# EAGLE design ESP_DIN_V1.1 (EAGLE 9.0.1)
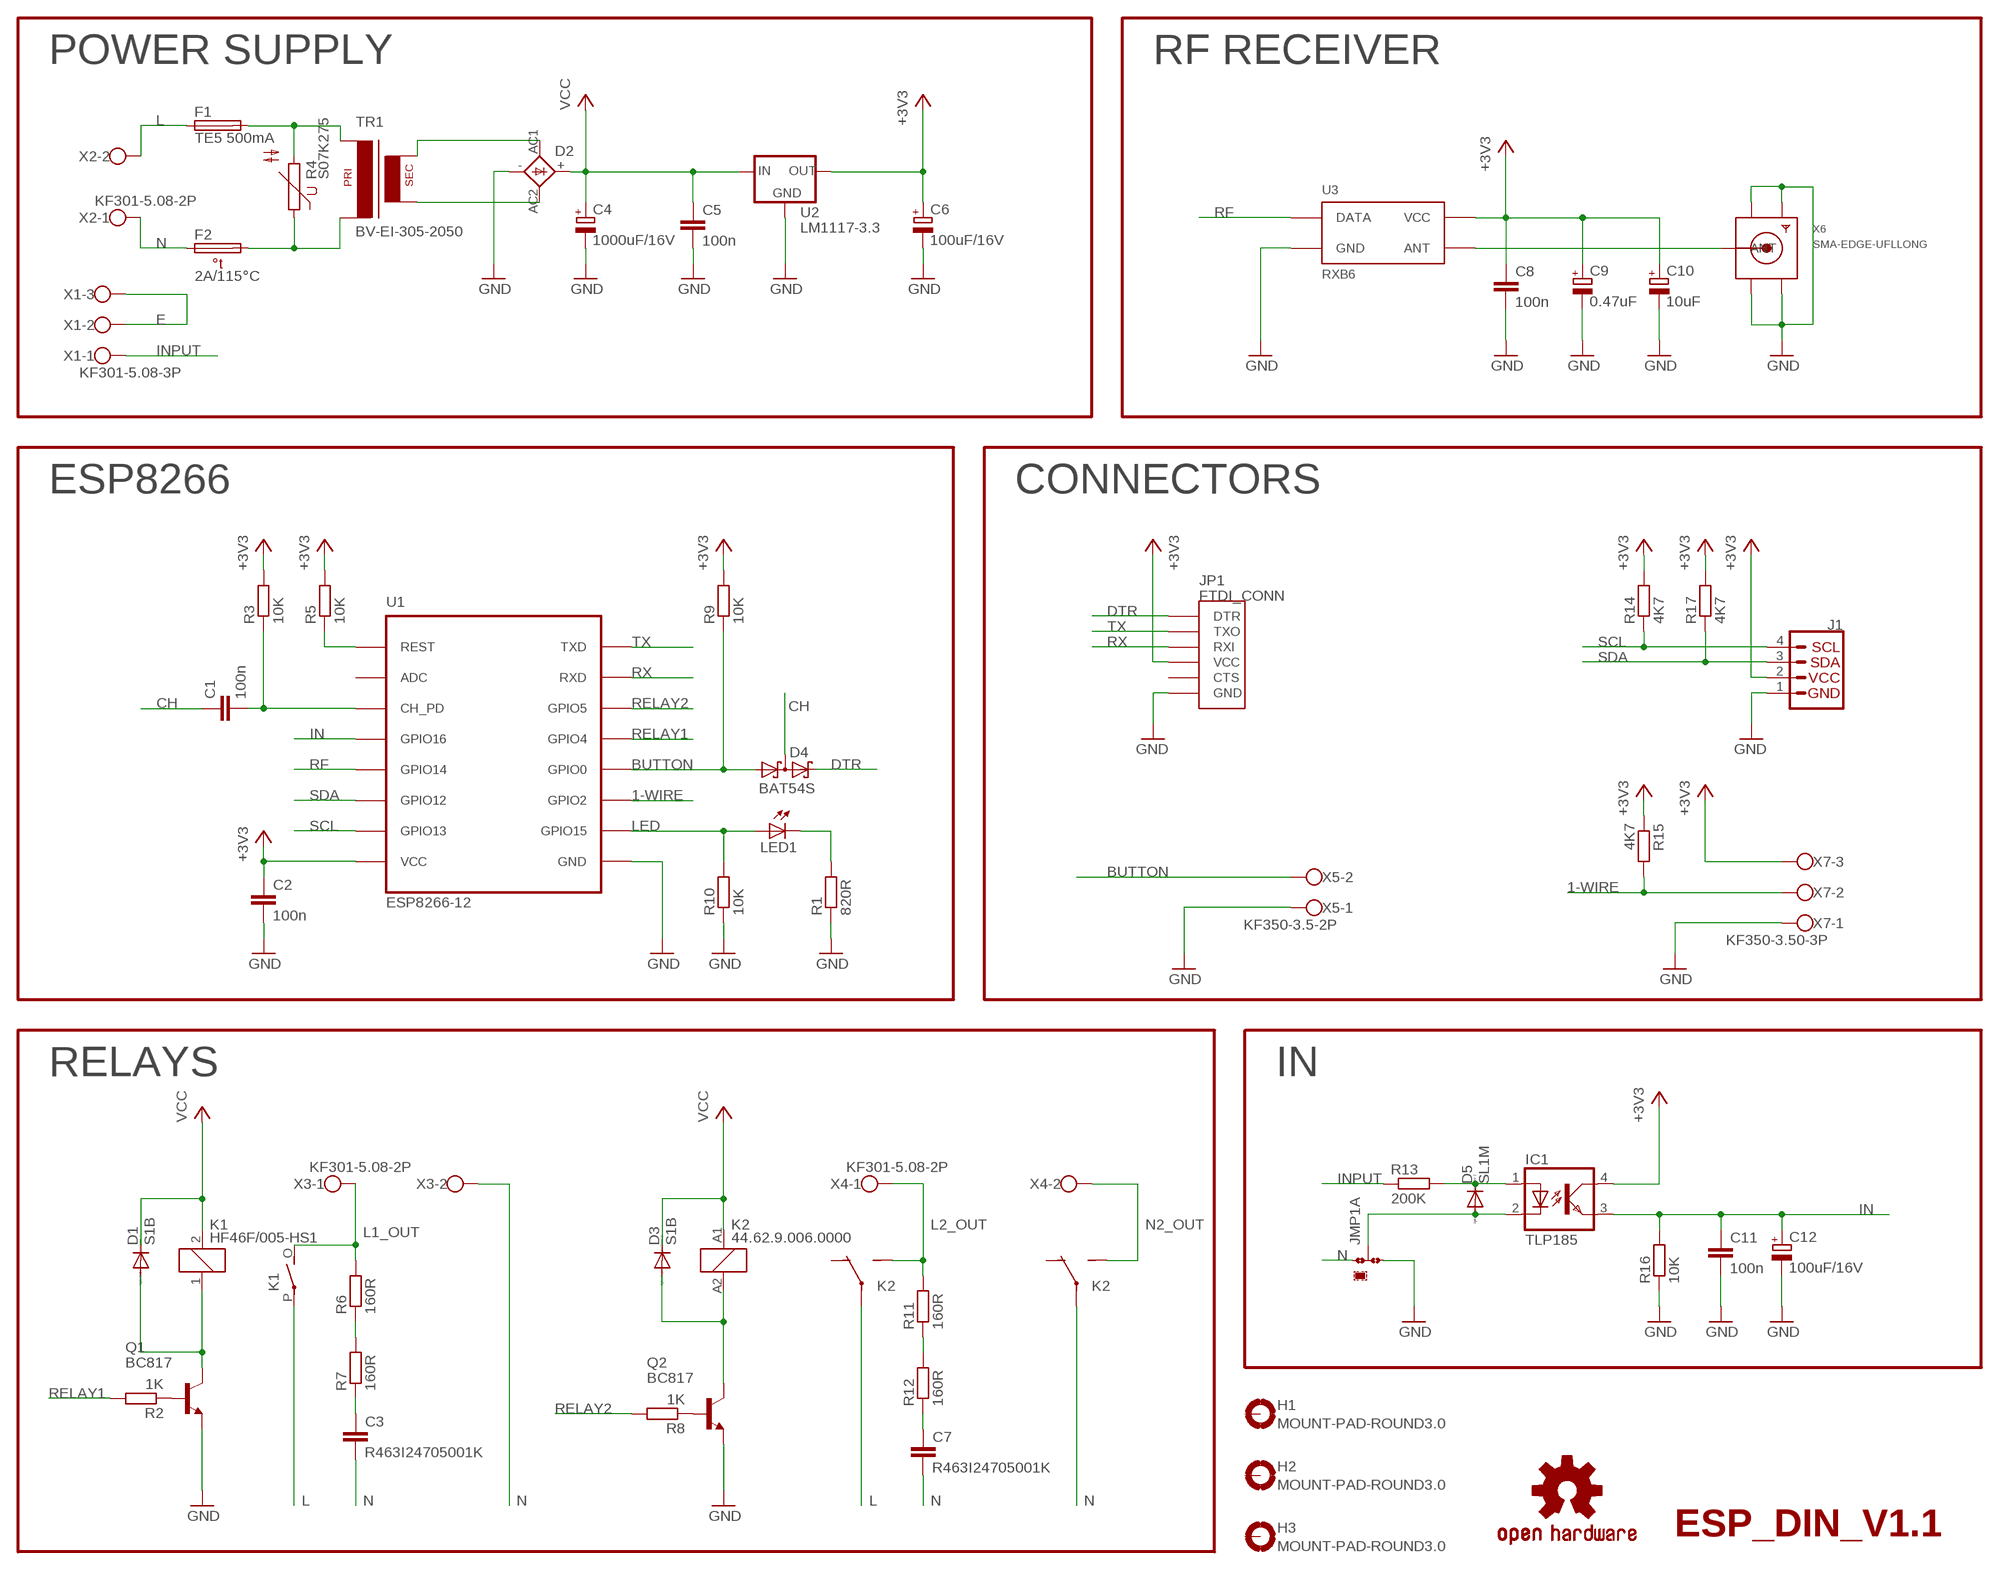
[diagram p0: schematic, sheet 1]

## Parts
C1  100n  C-EUC0805  [C0805]
C2  100n  C-EUC0805  [C0805]
C3  R463I24705001K  C-EU150-084X183  [C150-084X183]
C4  1000uF/16V  CPOL-EUTT5D10  [TT5D10]
C5  100n  C-EUC0805  [C0805]
C6  100uF/16V  CPOL-EUE2-5  [E2-5]
C7  R463I24705001K  C-EU150-084X183  [C150-084X183]
C8  100n  C-EUC0805  [C0805]
C9  0.47uF  CPOL-EUSMCA  [SMC_A]
C10  10uF  CPOL-EUSMCA  [SMC_A]
C11  100n  C-EUC0805  [C0805]
C12  100uF/16V  CPOL-EUE2-5  [E2-5]
D1  S1B  [DO214AC]
D2  KBP307  [KBP307]
D3  S1B  [DO214AC]
D4  BAT54S  [SOT23]
D5  SL1M  [SOD123]
F1  TE5 500mA  TE5  [TE5]
F2  2A/115°C  THERMAL_CUTOFF  [THERMAL_6.35]
H1  MOUNT-PAD-ROUND3.0  [3,0-PAD]
H2  MOUNT-PAD-ROUND3.0  [3,0-PAD]
H3  MOUNT-PAD-ROUND3.0  [3,0-PAD]
IC1  TLP185  [SOP04]
J1  I2C_STANDARD_NO_SILK  [1X04_NO_SILK]
JMP1  JUMPER-0R-2010-A  [JUMPER-0R-2010-A]
JP1  FTDI_CONN  [FTDI]
K1  HF46F/005-HS1  HF46F-G/006-HS1  [HF46F]
K2  44.62.9.006.0000  [44.52]
LED1  LED3MM  [LED3MM]
LOGO1  OSHW-LOGOM-COPPER  [OSHW-LOGO-M_COPPER]
Q1  BC817  BC817-40SMD  [SOT23-BEC]
Q2  BC817  BC817-40SMD  [SOT23-BEC]
R1  820R  R-EU_R0805  [R0805]
R2  1K  R-EU_R0805  [R0805]
R3  10K  R-EU_R0805  [R0805]
R4  S07K275  S07K250  [S07K250]
R5  10K  R-EU_R0805  [R0805]
R6  160R  R-EU_R2010  [R2010]
R7  160R  R-EU_R2010  [R2010]
R8  1K  R-EU_R0805  [R0805]
R9  10K  R-EU_R0805  [R0805]
R10  10K  R-EU_R0805  [R0805]
R11  160R  R-EU_R2010  [R2010]
R12  160R  R-EU_R2010  [R2010]
R13  200K  R-EU_R2010  [R2010]
R14  4K7  R-EU_R0805  [R0805]
R15  4K7  R-EU_R0805  [R0805]
R16  10K  R-EU_R0805  [R0805]
R17  4K7  R-EU_R0805  [R0805]
TR1  BV-EI-305-2050  [EI30-1]
U1  ESP8266-12  [ESP-12]
U2  LM1117-3.3  [SOT223]
U3  RXB6  [RXB6]
X1  KF301-5.08-3P  [KF301-5.08-3P]
X2  KF301-5.08-2P  [KF301-5.08-2P]
X3  KF301-5.08-2P  [KF301-5.08-2P]
X4  KF301-5.08-2P  [KF301-5.08-2P]
X5  KF350-3.5-2P  [KF350-3.50-2P]
X6  SMA-EDGE-UFLLONG  [SMA_EDGE_UFL_W]
X7  KF350-3.50-3P  [KF350-3.50-3P]

## Nets
1-WIRE: R15.2 U1.GPIO2 X7.2
+3V3: C2.1 C6.+ C8.1 C9.+ C10.+ IC1.4(COL) J1.2 JP1.P$4(VCC) R3.2 R5.2 R9.2 R14.2 R15.1 R17.2 U1.VCC U2.2(OUT) U2.4(OUT) U3.VCC U3.VCC@1(VCC) X7.3
ANT: U3.ANT X6.P(ANT)
BUTTON: D4.1(A1) R9.1 U1.GPIO0 X5.2
CH: C1.1 D4.3(C1A2)
DTR: D4.2(C2) JP1.P$1(DTR)
E: X1.2 X1.3
GND: C2.2 C4.- C5.2 C6.- C8.2 C9.- C10.- C11.2 C12.- D2.- J1.1 JMP1.3 JP1.P$6(GND) Q1.E Q2.E R1.1 R10.1 R16.1 U1.GND U2.1(GND) U3.GND U3.GND@1(GND) U3.GND@2(GND) X5.1 X6.GND@1(GND1) X6.GND@2(GND2) X6.GND@3(GND3) X6.GND@4(GND4) X7.1
IN: C11.1 C12.+ IC1.3(EMIT) R16.2 U1.GPIO16
INPUT: R13.1 X1.1
K1_POLE1: D1.A K1.1 Q1.C
K2_POLE1: D3.A K2.A2 Q2.C
L [220V]: F1.1 K1.P K2.11(P) X2.2
L1_OUT [220V]: K1.O(NO) R6.2 X3.1
L2_OUT [220V]: K2.14(NO) R11.2 X4.1
LED: LED1.A R10.2 U1.GPIO15
N [220V]: C3.2 C7.2 F2.1 JMP1.1 K2.21(P) X2.1 X3.2
N2_OUT [220V]: K2.24(NO) X4.2
N$2: Q2.B R8.1
N$3: D2.AC1 TR1.9(S4)
N$4: D2.AC2 TR1.7(S3)
N$5: LED1.K(C) R1.2
N$6: D5.A IC1.2(C) JMP1.2
N$7: D5.C IC1.1(A) R13.2
N$8: F1.2 R4.2 TR1.1
N$9: C3.1 R7.1
N$10: R5.1 U1.REST
N$11: C1.2 R3.1 U1.CH_PD
N$12: R6.1 R7.2
N$13: C7.1 R12.1
N$14: F2.2 R4.1 TR1.5(P2)
N$15: R11.1 R12.2
N$16: Q1.B R2.1
RELAY1: R2.2 U1.GPIO5(GPIO4)
RELAY2: R8.2 U1.GPIO4(GPIO5)
RF: U1.GPIO14 U3.DATA
RX: JP1.P$3(RXI) U1.RXD
SCL: J1.4 R14.1 U1.GPIO13
SDA: J1.3 R17.1 U1.GPIO12
TX: JP1.P$2(TXO) U1.TXD
VCC: C4.+ C5.1 D1.C D2.+ D3.C K1.2 K2.A1 U2.3(IN)
Unconnected: H1.B3,0(MOUNT) H2.B3,0(MOUNT) H3.B3,0(MOUNT) JP1.P$5(CTS) K2.12(NC) K2.22(NC) U1.ADC

## Notes on the sheet
- POWER SUPPLY | RF RECEIVER
- ESP8266 | CONNECTORS
- RELAYS | IN
- ESP_DIN_V1.1

## Library data of the parts
C1 C8 = rcl:C-EU: CAPACITOR, European symbol
C2 C3 C5 C7 C11 = rcl:C-EU: CAPACITOR, European symbol; SPICEPREFIX: C
C4 C6 C9 C10 C12 = rcl:CPOL-EU: POLARIZED CAPACITOR, European symbol; SPICEPREFIX: C
D1 D3 = my-diode:S?*: Rectifier Diode; V: 70
D2 = my-diode:KBP307: Bridge Rectifier
D4 = diode:BAT54S: Schottky Diodes Pin connection corrected 2011-05-04 Source: Fairchild .. BAT54.pdf
D5 = my-diode:SL1*: Silicon Rectifier Diode; V: 1000
F1 = fuse:TE5: FUSE Wickmann; OC_FARNELL: unknown; OC_NEWARK: unknown
F2 = my-fuses:THERMAL_CUTOFF
H1-H3 = holes:MOUNT-PAD-ROUND: MOUNTING PAD, round
IC1 = my-opto:TLP185: Photocoupler
J1 = SparkFun-Connectors:I2C_STANDARD: SparkFun I2C Standard Pinout Header SparkFun has standardized on a pinout for all I2C based sensor breakouts. This pinout allows I2C boards to be plugged directly into the headers on Arduino Uno compatible boards, and to be daisy chained easily. Example SparkFun Products: SparkFun Atmospheric Sensor Breakout - BME280 <https://www.sparkfun.com/products/13676> SparkFun Altitude/Pressure Sensor Breakout - MPL3115A2 <https://www.sparkfun.com/products/11084> SparkFun TOF Range Finder Sensor - VL6180 <https://www.sparkfun.com/products/12785>
JMP1 = my-jumper:JUMPER-0R-?-A: 0R jumper
JP1 = my-connectors:FTDI_CONN: Connector which mates to FTDI basic or FTDI cable.
K1 = my-relay:HF46F-G/*-HS1: Subminiature power relay
K2 = my-relay:44.62.9.*.0000: Miniature PCB relay 8A
LED1 = led:LED: LED OSRAM: - CHIPLED LG R971, LG N971, LY N971, LG Q971, LY Q971, LO R971, LY R971 LH N974, LH R974 LS Q976, LO Q976, LY Q976 LO Q996 - Hyper CHIPLED LW Q18S LB Q993, LB Q99A, LB R99A - SideLED LS A670, LO A670, LY A670, LG A670, LP A670 LB A673, LV A673, LT A673, LW A673 LH A674 LY A675 LS A676, LA A676, LO A676, LY A676, LW A676 LS A679, LY A679, LG A679 - Hyper Micro SIDELED® LS Y876, LA Y876, LO Y876, LY Y876 LT Y87S - SmartLED LW L88C, LW L88S LB L89C, LB L89S, LG L890 LS L89K, LO L89K, LY L89K LS L896, LA L896, LO L896, LY L896 - TOPLED LS T670, LO T670, LY T670, LG T670, LP T670 LSG T670, LSP T670, LSY T670, LOP T670, LYG T670 LG T671, LOG T671, LSG T671 LB T673, LV T673, LT T673, LW T673 LH T674 LS T676, LA T676, LO T676, LY T676, LB T676, LH T676, LSB T676, LW T676 LB T67C, LV T67C, LT T67C, LS T67K, LO T67K, LY T67K, LW E67C LS E67B, LA E67B, LO E67B, LY E67B, LB E67C, LV E67C, LT E67C LW T67C LS T679, LY T679, LG T679 LS T770, LO T770, LY T770, LG T770, LP T770 LB T773, LV T773, LT T773, LW T773 LH T774 LS E675, LA E675, LY E675, LS T675 LS T776, LA T776, LO T776, LY T776, LB T776 LHGB T686 LT T68C, LB T68C - Hyper Mini TOPLED® LB M676 - Mini TOPLED Santana® LG M470 LS M47K, LO M47K, LY M47K Source: http://www.osram.convergy.de LUXEON: - LUMILED® LXK2-PW12-R00, LXK2-PW12-S00, LXK2-PW14-U00, LXK2-PW14-V00 LXK2-PM12-R00, LXK2-PM12-S00, LXK2-PM14-U00 LXK2-PE12-Q00, LXK2-PE12-R00, LXK2-PE12-S00, LXK2-PE14-T00, LXK2-PE14-U00 LXK2-PB12-K00, LXK2-PB12-L00, LXK2-PB12-M00, LXK2-PB14-N00, LXK2-PB14-P00, LXK2-PB14-Q00 LXK2-PR12-L00, LXK2-PR12-M00, LXK2-PR14-Q00, LXK2-PR14-R00 LXK2-PD12-Q00, LXK2-PD12-R00, LXK2-PD12-S00 LXK2-PH12-R00, LXK2-PH12-S00 LXK2-PL12-P00, LXK2-PL12-Q00, LXK2-PL12-R00 Source: www.luxeon.com KINGBRIGHT: KA-3528ASYC Source: www.kingbright.com
LOGO1 = SparkFun-Aesthetics:OSHW-LOGO: Open-Source Hardware (OSHW) Logo This logo indicates the piece of hardware it is found on incorporates a OSHW license and/or adheres to the definition of open source hardware found here: http://freedomdefined.org/OSHW
Q1 Q2 = transistor-npn:BC817*: NPN Transistor
R1-R3 R5-R17 = rcl:R-EU_: RESISTOR, European symbol; SPICEPREFIX: R
R4 = varistor:S07K250: VARISTOR
TR1 = my-power:BV-EI-?*: Transformer; VOLTAGE: 6
U1 = my-ESP8266:ESP8266
U2 = my-power:LM1117-*: LDO regulator
U3 = my-modules:RXB6: 433mHz receiver
X1 = my-connectors:KF301-?-3P: Screw terminal
X2-X4 = my-connectors:KF301-?-2P: Screw terminal
X5 = my-connectors:KF350-3.5-2P: Screw terminal 3.5mm pitch
X6 = my-connectors:SMA-EDGE-UFL: SMA connector
X7 = my-connectors:KF350-3.50-3P: Screw terminal 3.5mm pitch

## Net classes
1 220V: width 1.8 mm, clearance 0.2 mm

## Board
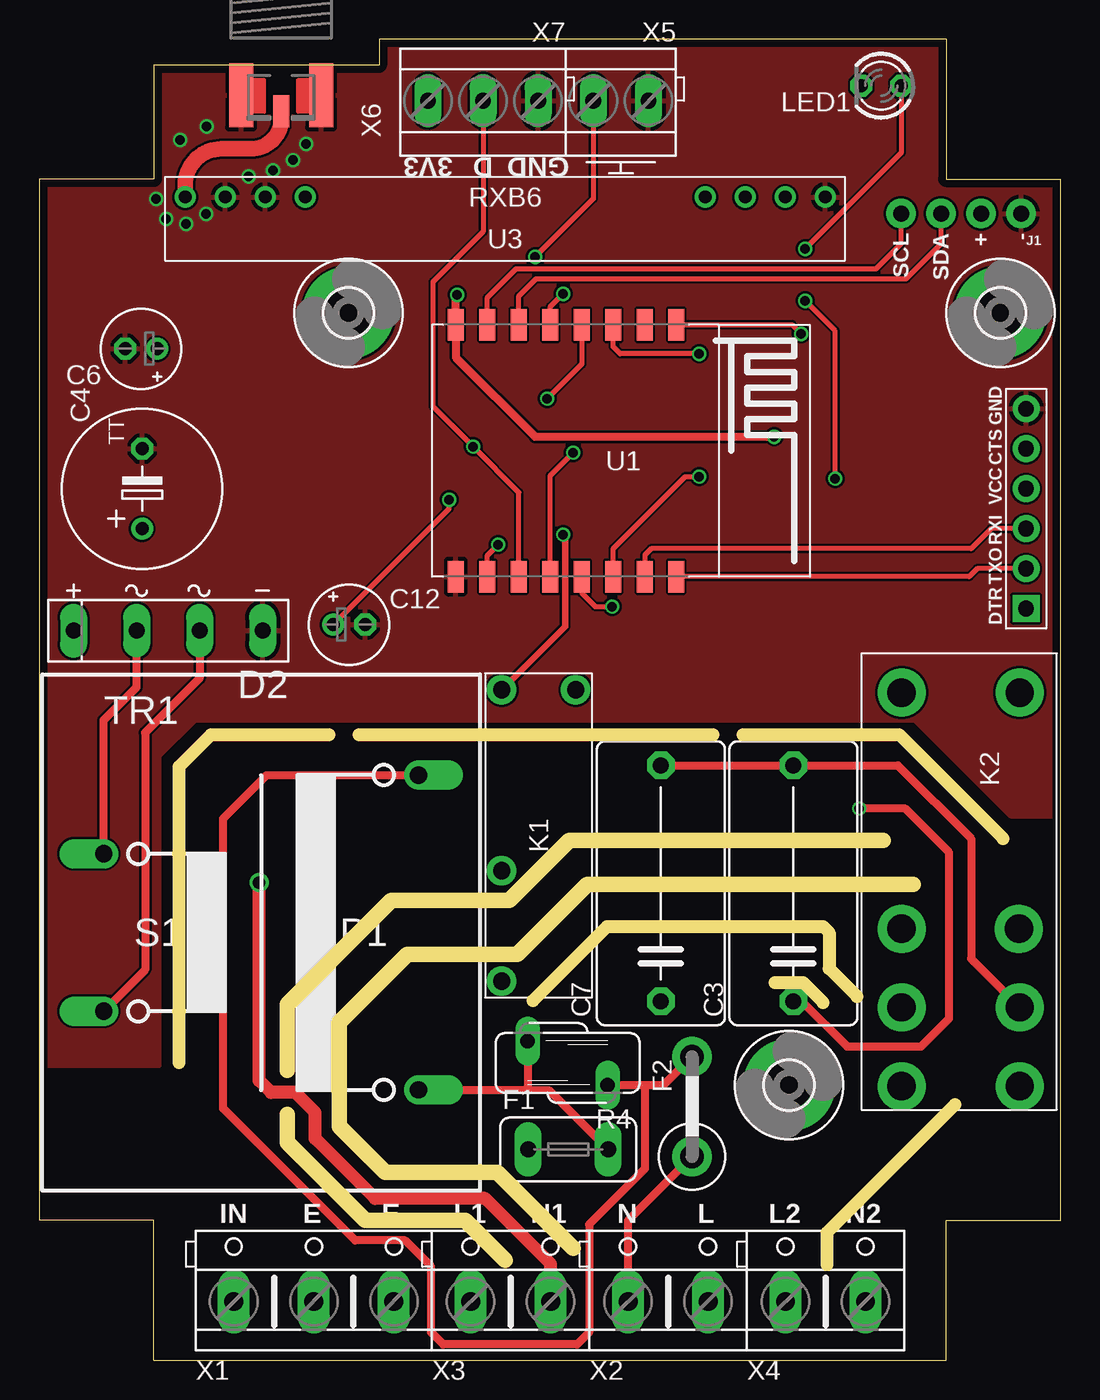
[diagram p1: board, top side]
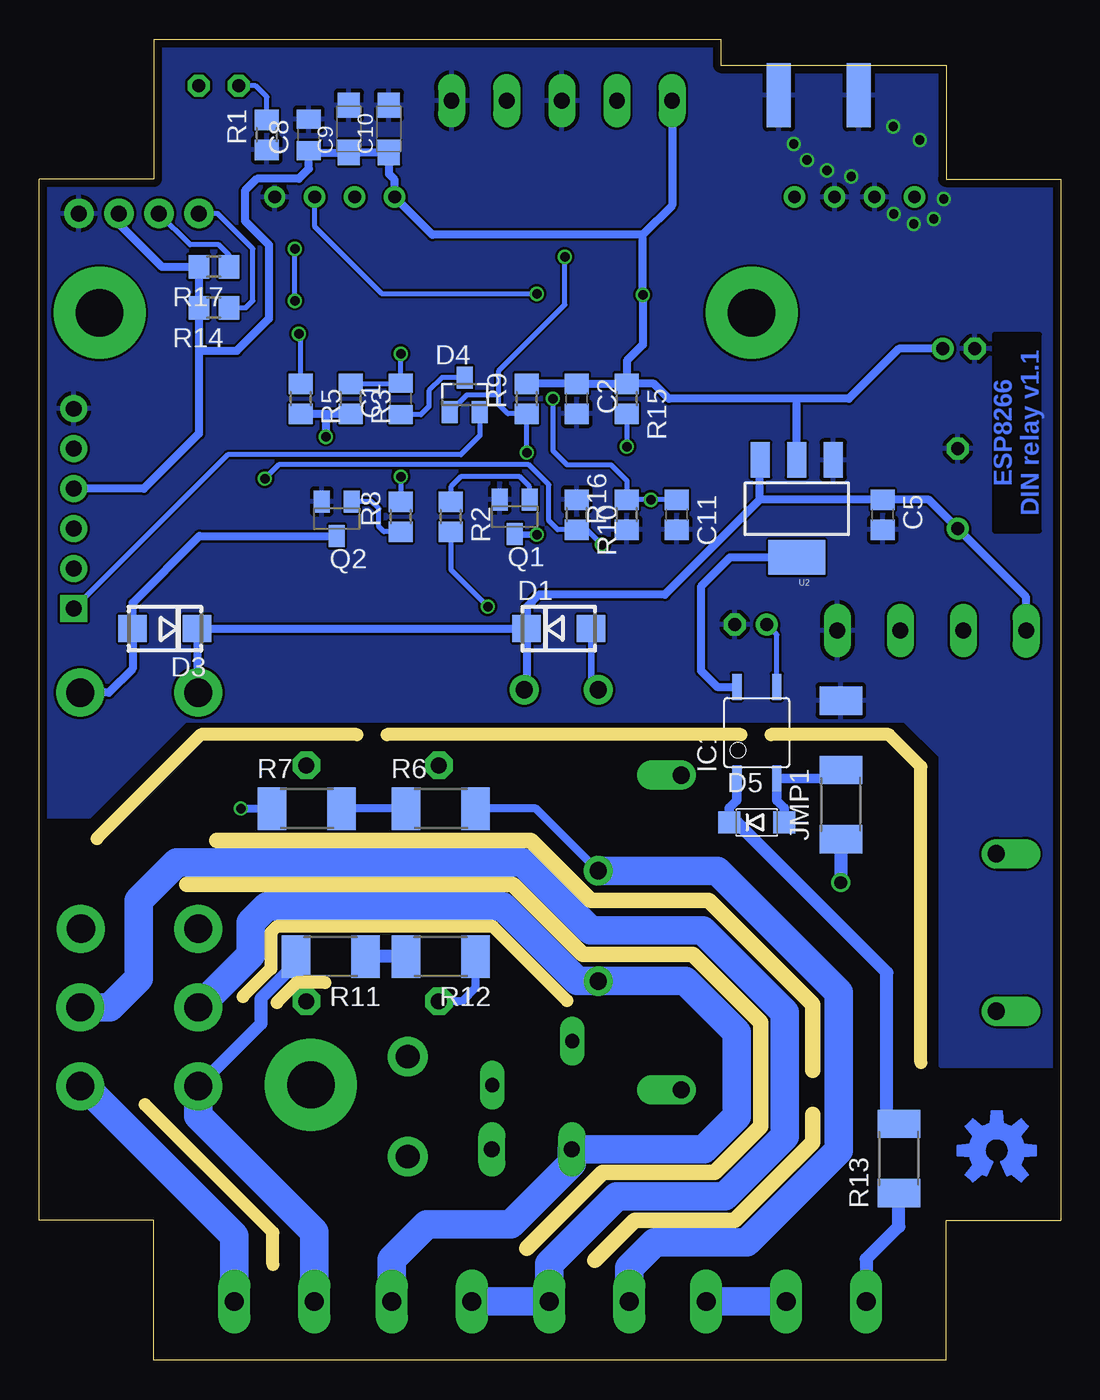
[diagram p2: board, bottom side, seen from below]

Size 64.85 x 83.91 mm. Coordinates in mm from the lower left corner, seen from the top.
Outline: 7.27,0 57.58,0 57.58,8.88 64.85,8.88 64.85,75.03 57.58,75.03 57.58,83.91 21.57,83.91 21.57,82.28 7.27,82.28 7.27,75.03 0,75.03 0,8.88 7.27,8.88 7.27,0
Copper layers (1*16): Top 0.035mm / dielectric 1.6mm / Bottom 0.035mm
Design rules "Elecrow_2-layer_PCB_eagle_rule *": minimum track width 6mil, minimum drill 12mil, track to track 6mil, track to pad 6mil, pad to pad 6mil, via to via 8mil, smd to smd 0mil, copper to edge 20mil, drill to drill 10mil, minimum pad ring 8mil, minimum via ring 6mil, stop-mask expansion 0mil, vias tented up to drill 100mil, thermal gap 10mil
Milling: 32 lines

### Footprints (pad centres in the part's own frame; a part is rotated, then mirrored left to right if it is on the bottom)
C0805 = smd 1.2 x 1.5: 1 -1,0; 2 1,0
C0805' = smd 1.3 x 1.5: 1 -0.95,0; 2 0.95,0
C150-084X183 = drill 1.016 octagon: 1 -7.493,0; 2 7.493,0
TT5D10 = drill 0.813: + -2.54,0 | drill 0.813 octagon: - 2.54,0
E2-5 = drill 0.813 pad 1.27: + -1.016,0 | drill 0.813 pad 1.27 octagon: - 1.016,0
SMC_A = smd 1.6 x 1.4: + -1.5,0; - 1.5,0
DO214AC = smd 1.8 x 1.7: A 2.05,0; C -2.05,0
KBP307 = drill 1.016 long: + 6,0 | drill 1 long: - -6,0; AC1 -2,0; AC2 2,0
SOT23 = smd 1 x 1.4: 1 -0.95,-1.1; 2 0.95,-1.1; 3 0,1.1
SOD123 = smd 1.4 x 1.4: A 1.75,0; C -1.75,0
TE5 = drill 1.016 long: 1 -2.54,0; 2 2.54,0
THERMAL_6.35 = drill 1.5: 1 -5.08,0; 2 1.27,0
3,0-PAD = drill 3 pad 5.842: B3,0 0,0
SOP04 = smd 1.65 x 0.6: 1 -2.9,1.27; 2 -2.9,-1.27; 3 2.9,-1.27; 4 2.9,1.27
1X04_NO_SILK = drill 1.016 pad 1.88: 1 0,0; 2 2.54,0; 3 5.08,0; 4 7.62,0
JUMPER-0R-2010-A = smd 1.8 x 2.7: 1 -2.2,0; 2 2.2,0; 3 6.6,0
FTDI = drill 1 pad 1.651 square: P$1 -6.35,0 | drill 1 pad 1.651: P$2 -3.81,0; P$3 -1.27,0; P$4 1.27,0; P$5 3.81,0; P$6 6.35,0
HF46F = drill 1.1 pad 1.778: 1 -9.25,-2.35; 2 -9.25,2.35; O 2.25,-2.35; P 9.25,-2.35
44.52 = drill 1.8 pad 3.048: 11 8,-3.65; 12 3,-3.65; 14 13,-3.65; 21 8,3.85; 22 3,3.8; 24 13,3.85; A1 -12,-3.65; A2 -12,3.85
LED3MM = drill 0.813 octagon: A -1.27,0; K 1.27,0
SOT23-BEC = smd 1 x 1.4: B -0.95,-1.1; C 0,1.1; E 0.95,-1.1
R0805 = smd 1.3 x 1.5: 1 -0.95,0; 2 0.95,0
S07K250 = drill 0.914 long: 1 -1.397,-2.54; 2 1.397,2.54
R2010 = smd 1.8 x 2.7: 1 -2.2,0; 2 2.2,0
EI30-1 = drill 1.1 offset: 1 10,-10; 5 10,10; 7 -10,5; 9 -10,-5
ESP-12 = smd 1 x 2: ADC -1.5,-8; CH_PD 0.5,-8; GND 10.5,8; GPIO0 4.5,8; GPIO2 6.5,8; GPIO4 0.5,8; GPIO5 2.5,8; GPIO12 6.5,-8; GPIO13 8.5,-8; GPIO14 4.5,-8; GPIO15 8.5,8; GPIO16 2.5,-8; REST -3.5,-8; RXD -1.5,8; TXD -3.5,8; VCC 10.5,-8
SOT223 = smd 1.219 x 2.235: 1 -2.311,-3.099; 2 0,-3.099; 3 2.311,-3.099 | smd 3.6 x 2.2: 4 0,3.099
RXB6 = drill 0.8: ANT 20.31,-1.38; DATA -17.79,-1.38; DER -15.25,-1.38; GND -20.33,-1.38; GND@1 15.23,-1.38; GND@2 17.77,-1.38; VCC -12.71,-1.38; VCC@1 12.69,-1.38
KF301-5.08-3P = drill 1.2 long: 1 -5.08,0; 2 0,0; 3 5.08,0
KF301-5.08-2P = drill 1.2 long: 1 -2.54,0; 2 2.54,0
KF350-3.50-2P = drill 1 long: 1 -1.75,0; 2 1.75,0
SMA_EDGE_UFL_W = smd 4.064 x 1.524: GND@1 2.032,-2.54; GND@2 2.032,2.54 | smd 4.064 x 1.524 bottom: GND@3 2.032,2.54; GND@4 2.032,-2.54 | smd 2.032 x 1.016: P 3.048,0
KF350-3.50-3P = drill 1 long: 1 -3.5,0; 2 0,0; 3 3.5,0

### Placement (x,y rotation side)
C1  41.9,61.08 90 bottom
C2  100n  [C0805']  30.72,61.08 270 bottom
C3  47.89,30.29 90 top
C4  6.53,55.36 90 top
C5  100n  [C0805']  11.29,53.71 270 bottom
C6  6.47,64.25 180 top
C7  39.47,30.29 90 top
C8  47.74,77.84 90 bottom
C9  45.2,78.22 90 bottom
C10  42.66,78.22 90 bottom
C11  100n  [C0805']  24.37,53.71 270 bottom
C12  19.67,46.72 0 top
D1  31.86,46.47 0 bottom
D2  8.18,46.34 180 top
D3  56.88,46.47 180 bottom
D4  37.83,61.33 0 bottom
D5  19.29,34.15 0 bottom
F1  33.58,13.39 0 top
F2  41.45,18.02 90 top
H1  19.62,66.53 0 top
H2  47.61,17.48 0 top
H3  61.03,66.53 0 top
IC1  19.29,39.87 90 bottom
J1  62.34,72.84 180 top
JMP1  13.96,35.29 90 bottom
JP1  62.66,54.09 90 top
K1  31.71,33.33 270 top
K2  58.41,30.4 270 top
LED1  53.46,80.96 180 top
LOGO1  4.05,13.32 0 bottom
Q1  34.66,53.58 180 bottom
Q2  45.96,53.46 180 bottom
R1  50.41,77.84 90 bottom
R2  38.72,53.58 270 bottom
R3  45.07,61.08 270 bottom
R4  33.55,18.88 90 top
R5  48.25,61.08 270 bottom
R6  39.36,35.04 0 bottom
R7  47.87,35.04 0 bottom
R8  41.9,53.58 90 bottom
R9  33.9,61.08 90 bottom
R10  30.72,53.71 270 bottom
R11  46.34,25.64 180 bottom
R12  39.36,25.64 180 bottom
R13  10.27,12.82 90 bottom
R14  53.77,66.85 180 bottom
R15  27.55,61.08 270 bottom
R16  27.55,53.71 90 bottom
R17  53.77,69.46 180 bottom
TR1  14.09,27.17 0 top
U1  36.95,57.77 180 top
U2  16.75,54.09 180 bottom
U3  29.57,72.51 180 top
X1  17.43,3.73 0 top
X2  39.93,3.73 0 top
X3  29.93,3.73 0 top
X4  49.93,3.73 0 top
X5  36.93,80.01 180 top
X6  15.36,82.38 270 top
X7  28.18,80.01 180 top

### Tracks (layer width: path | path; a pad name or v marks a point on that pad's centre or on a via)
1-WIRE  (via drill 0.6)
  Top 0.305: X7.2 28.18,71.67 25.01,68.51 25.01,60.57 v27.55,58.03 30.44,55.13 U1.GPIO2
  Bottom 0.305: R15.2 v27.55,58.03
+3V3  (via drill 0.6)
  Top 0.508: v46.66,58.66 31.49,58.66 26.45,63.7 U1.VCC 26.45,67.59 v26.53,67.68
  Bottom 0.508: C6.+ 10.27,64.25 13.45,61.08 16.74,61.08 | R5.2 46.66,60.12 | 46.66,60.12 R3.2 | 46.66,60.12 v46.66,58.66 | 16.74,61.08 16.75,61.07 U2.2 | 47.62,76.72 C9.+ C10.+ 42.66,75.36 42.29,74.99 U3.VCC 39.89,71.49 26.53,71.49 | 47.62,76.72 C8.1 | 47.62,76.72 47.74,76.6 47.74,75.68 48.38,75.05 51.04,75.05 51.8,74.28 51.8,72.38 50.28,70.85 50.28,66.16 52.31,64.12 54.72,64.12 | J1.2 59.8,72.19 57.07,69.46 R17.2 R14.2 54.72,64.12 | 16.74,61.08 24.88,61.08 25.83,62.03 27.42,62.03 | JP1.P$4 58.22,55.36 54.72,58.86 54.72,64.12 | R9.2 C2.1 R15.1 27.42,62.03 | 26.53,71.49 v26.53,67.68 26.53,64.5 27.55,63.49 27.55,62.15 27.42,62.03 | X7.3 24.68,73.34 26.53,71.49 | U2.4 20.99,50.99 22.85,49.14 22.85,43.8 21.81,42.77 IC1.4
ANT
  Top 1: U3.ANT 9.27,74.67 arc-90 11.55,76.95 13.45,76.95 arc90 15.36,78.86 X6.P
BUTTON  (via drill 0.6)
  Top 0.305: v33.9,57.65 32.45,56.19 U1.GPIO0 | X5.2 35.18,73.78 v31.48,70.09
  Bottom 0.305: D4.1 37.68,61.33 35.68,61.33 | 35.68,61.33 35.68,60.69 35.11,60.12 R9.1 v33.9,57.65 | v31.48,70.09 31.48,67.04 35.68,62.85 35.68,61.33
CH
  Bottom 0.305: D4.3 39.27,62.43 40.12,61.58 40.12,60.57 40.63,60.06 41.88,60.06 C1.1
DTR
  Bottom 0.305: D4.2 36.88,58.72 38.09,57.52 52.88,57.52 JP1.P$1
E
  Bottom 1.8: X1.3 X1.2
GND  (via drill 0.6)
  other vias: 10.62,78.38 9.32,72.19 7.42,73.78 8.05,72.51 14.84,75.58 16.11,76.23 16.94,77.26 10.59,72.82 8.94,77.52 13.29,75.2
  pour Bottom: 64.85,75.03 64.85,34.58 61.67,34.58 55.58,40.68 9.91,40.68 7.6,38.42 7.6,18.72 0,18.72 0,75.03 7.27,75.03 7.27,82.28 21.57,82.28 21.57,83.91 57.58,83.91 57.58,75.03
  pour Top: 0,75.03 0,18.72 7.6,18.72 7.6,38.42 9.91,40.68 55.58,40.68 61.67,34.58 64.85,34.58 64.85,75.03 57.58,75.03 57.58,83.91 21.57,83.91 21.57,82.28 7.27,82.28 7.27,75.03
IN  (via drill 0.6)
  Top 0.305: U1.GPIO16 34.45,63.27 v32.25,61.08 | C12.+ 26.02,54.09 v26.02,54.66
  Bottom 0.305: IC1.3 18.02,46.09 C12.+ | C11.1 v26.02,54.66 R16.2 27.55,55.87 28.56,56.88 31.36,56.88 32.25,57.77 v32.25,61.08
INPUT
  Bottom 0.813: X1.1 12.34,6.43 10.27,8.5 R13.1
K1_POLE1  (via drill 0.6)
  Top 0.406: K1.1 33.39,46.61 33.39,52.31 v33.26,52.44
  Bottom 0.406: D1.A 29.82,43.04 K1.1 | Q1.C 34.62,52.44 v33.26,52.44
K2_POLE1
  Bottom 0.508: K2.A2 60.44,42.41 58.93,43.91 D3.A 58.93,48.1 54.68,52.36 Q2.C
L
  Bottom 1.8: K2.11 51.42,25.74 51.42,27.8 50.41,28.82 35.42,28.82 30.69,24.08 K1.P 23.83,24.08 20.56,20.82 20.56,15.48 22.66,13.39 F1.1 31.04,12.5 34.91,8.62 40.25,8.62 42.47,6.41 X2.2
L1_OUT
  Bottom 0.508: K1.O 33.32,35.04 R6.2
  Bottom 1.8: X3.1 27.38,5.86 25.77,7.48 19.93,7.48 14.09,13.32 14.09,23.36 21.81,31.08 K1.O
L2_OUT
  Bottom 0.813: K2.14 50.79,21.37 50.79,22.97 48.54,25.22 R11.2
  Bottom 1.8: X4.1 47.39,8.14 54.76,15.52 K2.14
LED  (via drill 0.6)
  Top 0.305: U1.GPIO15 28.45,51.11 v29.13,51.8 | LED1.A 54.73,76.7 v48.63,70.6 | v50.53,56 50.53,65.39 v48.63,67.3
  Bottom 0.305: v29.13,51.8 30.09,52.76 R10.2 31.93,52.76 32.5,53.33 32.5,55.61 33.77,56.88 49.65,56.88 v50.53,56 | v48.63,67.3 v48.63,70.6
N  (via drill 0.8)
  Top 0.508: C7.2 C3.2 54.52,37.79 59.17,33.14 59.17,25.49 K2.21 | X2.1 37.39,8.87 F2.1
  Top 0.813: X3.2 32.47,6.12 28.31,10.27 21.32,10.27 17.51,14.09 17.51,15.74 16.24,17.01 14.72,17.01 13.96,17.77 v13.96,30.34
  Bottom 0.813: JMP1.1 v13.96,30.34
  Bottom 1.8: K2.21 60.38,22.4 58.54,24.25 58.54,29.2 56.12,31.61 34.15,31.61 29.83,27.29 22.72,27.29 17.51,22.09 17.51,14.21 21.32,10.4 28.18,10.4 32.47,6.12 X3.2 X2.1
N2_OUT
  Bottom 1.8: X4.2 52.47,7.89 61.98,17.4 K2.24
N$2
  Bottom 0.305: Q2.B 43.76,54.55 43.3,54.09 43.3,52.95 42.98,52.63 R8.1
N$3
  Top 0.508: D2.AC1 10.18,43.33 6.72,39.87 6.72,24.8 TR1.9
N$4
  Top 0.508: D2.AC2 6.18,42.76 4.08,40.66 TR1.7
N$5
  Bottom 0.305: R1.2 50.41,80.25 51.11,80.96 LED1.K
N$6
  Bottom 0.61: D5.A 17.54,35.07 18.02,35.55 IC1.2 14.49,36.97 JMP1.2
N$7
  Bottom 0.61: IC1.1 20.56,35.55 21.04,35.07 D5.C
  Bottom 0.813: R13.2 11.04,15.78 11.04,24.63 20.56,34.15 D5.C
N$8
  Top 0.508: TR1.1 30.85,17.17 | 30.85,17.17 32.34,17.17 F1.2 | R4.2 31.01,17.32 30.85,17.17
N$9  (via drill 0.6)
  Top 0.508: C3.1 48.42,22.8 51.3,19.93 56,19.93 57.77,21.7 57.77,32.25 54.98,35.04 v52.06,35.04
  Bottom 0.508: v52.06,35.04 R7.1
N$10  (via drill 0.6)
  Top 0.305: U1.REST 47.8,65.77 v48.38,65.2
  Bottom 0.305: R5.1 48.25,65.08 v48.38,65.2
N$11  (via drill 0.6)
  Top 0.305: v41.9,63.93 36.88,63.93 36.44,64.38 U1.CH_PD
  Bottom 0.305: R3.1 41.95,62.03 C1.2 v41.9,63.93
N$12
  Bottom 0.508: R6.1 R7.2
N$13
  Bottom 0.508: R12.1 37.16,23.65 38.01,22.8 C7.1
N$14
  Top 0.508: TR1.5 14.43,37.17 11.67,34.41 11.67,15.99 20.05,7.61 23.23,7.61 24.88,5.96 24.88,1.77 25.64,1 34.15,1 34.91,1.77 34.91,8.62 38.47,12.18 38.47,17.48 | R4.1 38.47,17.48 | 38.47,17.48 39.64,17.48 F2.2
N$15
  Bottom 0.813: R12.2 R11.1
N$16
  Bottom 0.305: R2.1 38.72,55.49 38.09,56.12 34.34,56.12 33.71,55.49 Q1.B
RELAY1  (via drill 0.6)
  Top 0.305: U1.GPIO5 34.45,48.72 35.29,47.87 v36.37,47.87
  Bottom 0.305: R2.2 38.72,50.22 v36.37,47.87
RELAY2  (via drill 0.6)
  Top 0.305: U1.GPIO4 36.45,51.56 41.01,56.12 v41.9,56.12
  Bottom 0.305: v41.9,56.12 R8.2
RF  (via drill 0.6)
  Top 0.305: U1.GPIO14 32.45,66.92 v33.26,67.74
  Bottom 0.305: U3.DATA 47.36,72 43.1,67.74 v33.26,67.74
RX
  Top 0.305: U1.RXD 38.45,51.15 38.85,51.55 59.17,51.55 60.44,52.82 JP1.P$3
SCL
  Top 0.305: U1.GPIO13 28.45,67.5 30.28,69.33 53.14,69.33 54.73,70.92 J1.4
  Bottom 0.305: R14.1 51.74,66.85 51.3,67.3 51.3,70.6 53.53,72.84 J1.4
SDA
  Top 0.305: U1.GPIO12 30.44,67.59 31.55,68.7 55.04,68.7 57.27,70.92 J1.3
  Bottom 0.305: R17.1 52.82,70.22 53.46,70.85 55.28,70.85 J1.3
TX
  Top 0.305: U1.TXD 59.04,49.77 59.55,50.28 JP1.P$2
VCC
  Bottom 0.508: D1.C D3.C 54.83,42.48 K2.A1 | D2.+ 2.18,48.47 C4.+ 8.37,54.66 C5.1 19.1,54.66 | D1.C 33.92,42.73 K1.2 | D1.C 33.92,47.85 33.14,48.63 25.13,48.63 19.1,54.66 | 19.1,54.66 19.1,57.15 U2.3

### Text on the board
Bottom: ESP8266 / DIN relay v1.1
tPlace: 3V3 | D | GND | SCL | SDA | + | - | IN | E | E | L1 | N1 | N | L | L2 | N2
Notes: Plastic case Z-100 by Kradex